# Altium schematic sheet Sheet2.SchDoc
size A3
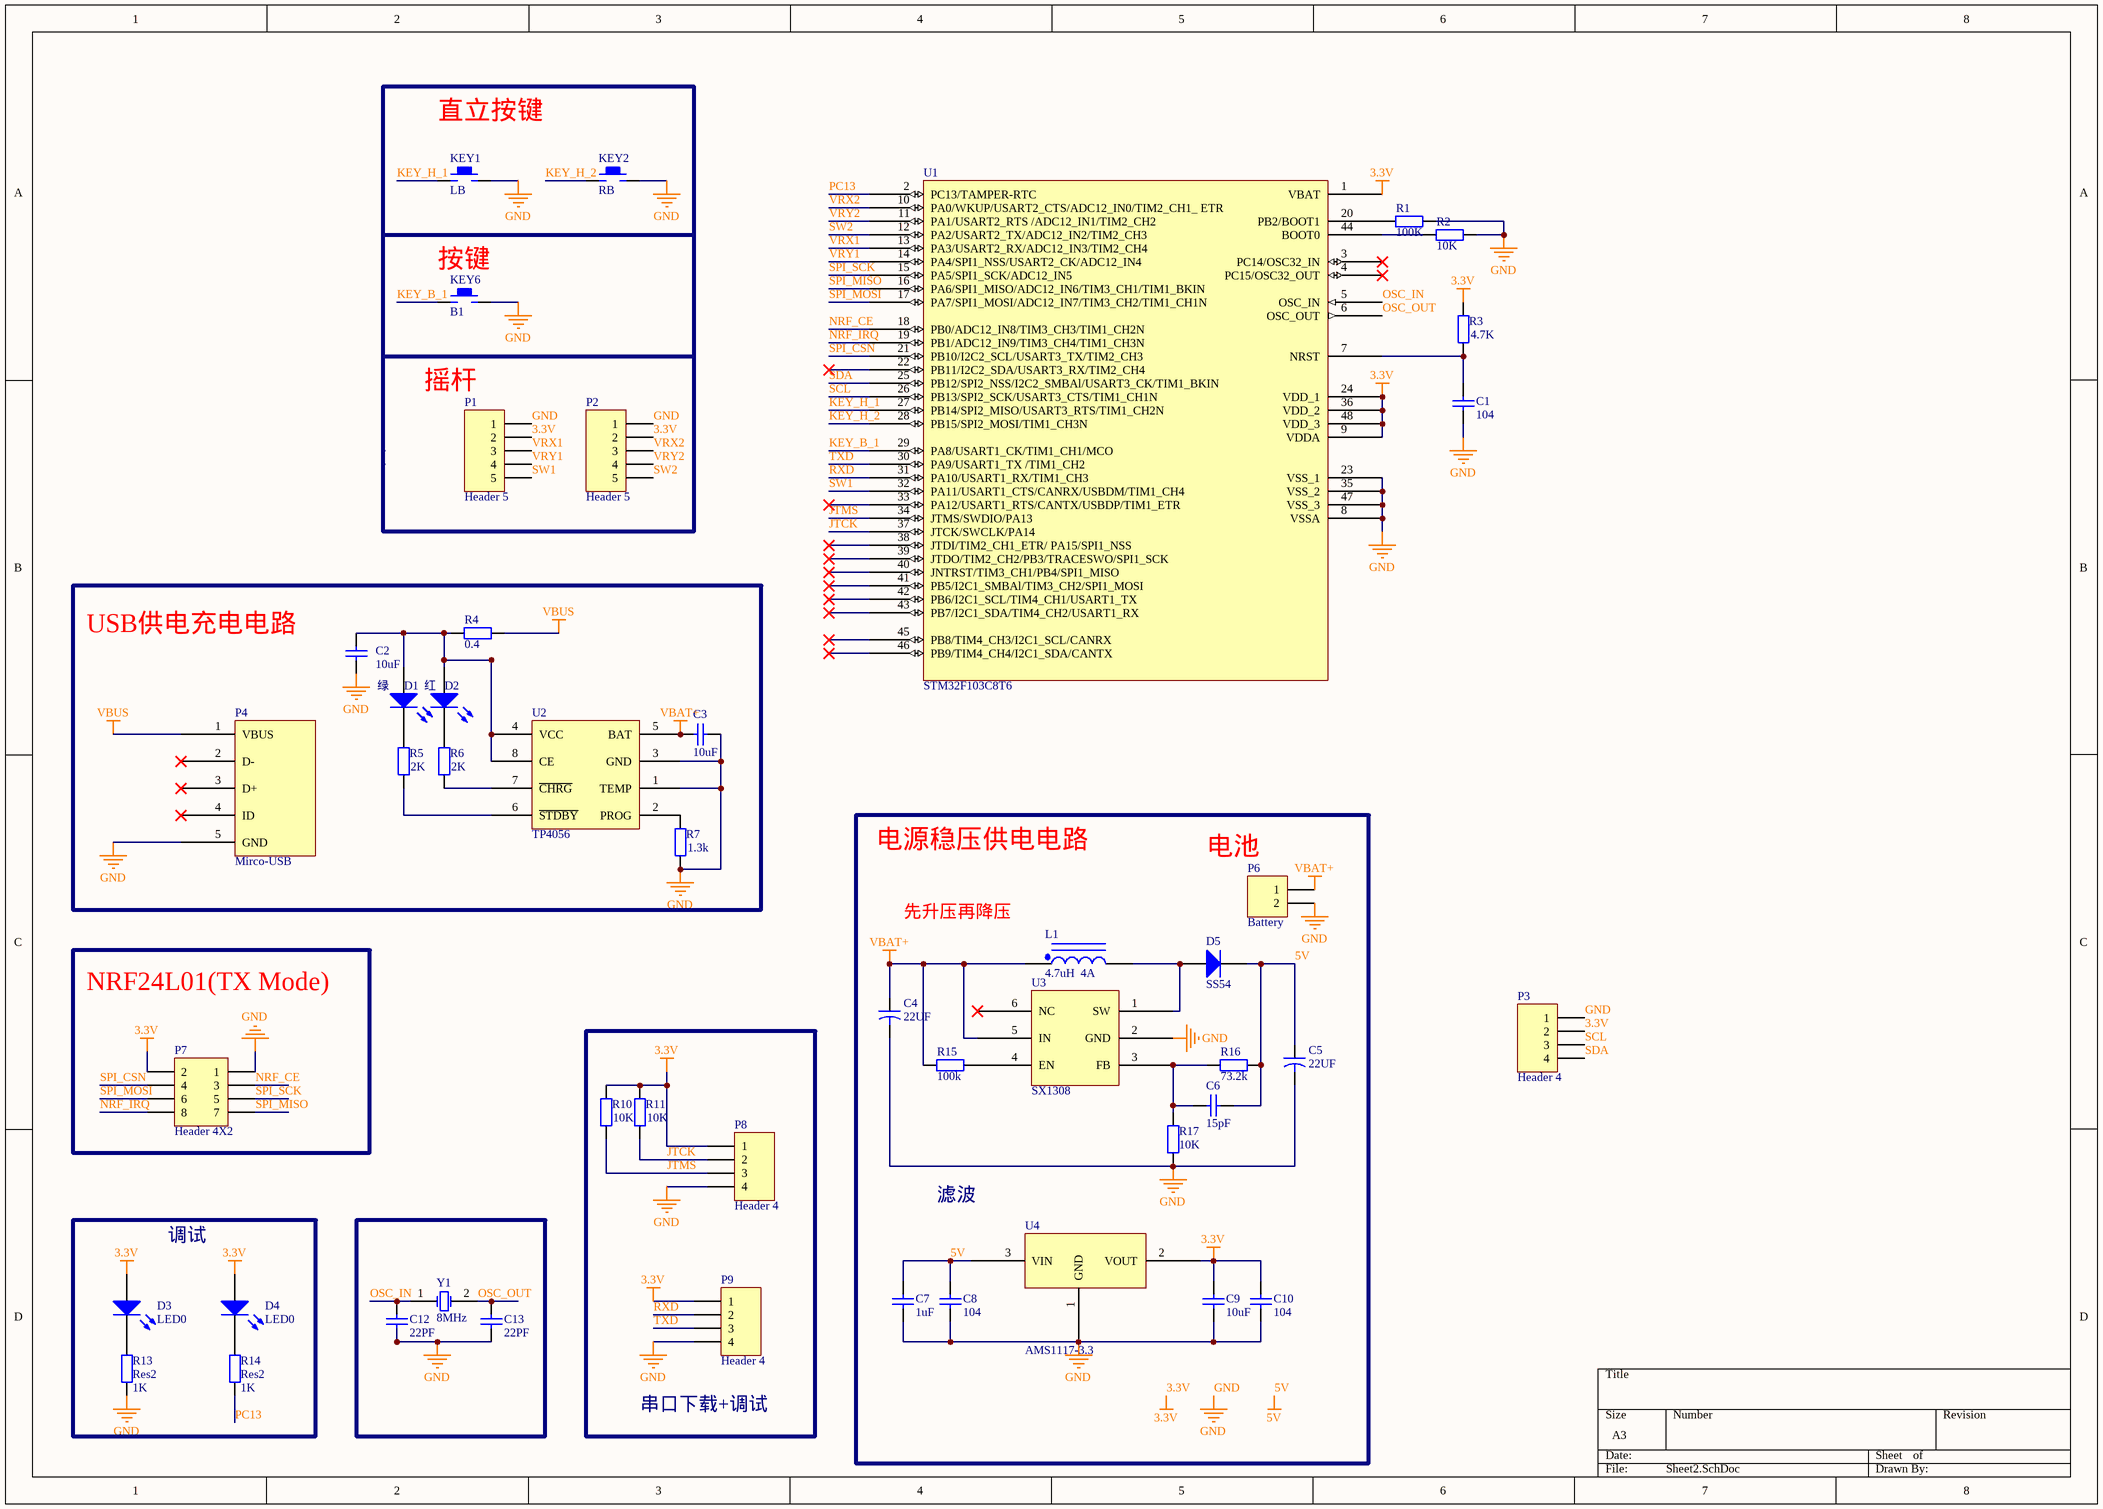
[diagram p0: Sheet2.SchDoc]

## Parts
C1  value 104  [0603]  (hidden comment: Cap)
C2  value 10uF  [0603]  (hidden comment: Cap)
C3  value 10uF  [0603]  (hidden comment: Cap)
C4  value 22UF  [0603]  (hidden comment: Cap2)
C5  value 22UF  [0603]  (hidden comment: Cap2)
C6  value 15pF  [0603]  (hidden comment: Cap)
C7  value 1uF  [0603]  (hidden comment: Cap)
C8  value 104  [0603]  (hidden comment: Cap)
C9  value 10uF  [0603]  (hidden comment: Cap)
C10  value 104  [0603]  (hidden comment: Cap)
C12  value 22PF  [0603]  (hidden comment: Cap)
C13  value 22PF  [0603]  (hidden comment: Cap)
D1  绿  [0603-LED]
D2  红  [0603-LED]
D3  LED0  [0603-LED]
D4  LED0  [0603-LED]
D5  SS54  [DO-214AA/SMB]
KEY1  LB  [KEY 侧式直插]
KEY2  RB  [KEY 侧式直插]
KEY6  B1  [KEY_M]
L1  value 4.7uH  4A  [0603]  (hidden comment: Inductor Iron Dot)
P1  Header 5  [摇杆1]
P2  Header 5  [摇杆1]
P3  Header 4  [HDR1X4]
P4  Mirco-USB  [microUSB]
P6  Battery  [BAT-2]
P7  Header 4X2  [HDR2X4]
P8  Header 4  [HDR1X4]
P9  Header 4  [HDR1X4]
R1  value 100K  [0603]  (hidden comment: Res2)
R2  value 10K  [0603]  (hidden comment: Res2)
R3  value 4.7K  [0603]  (hidden comment: Res2)
R4  value 0.4  [0603]  (hidden comment: Res2)
R5  value 2K  [0603]  (hidden comment: Res2)
R6  value 2K  [0603]  (hidden comment: Res2)
R7  value 1.3k  [0603]  (hidden comment: Res2)
R10  value 10K  [0603]  (hidden comment: Res2)
R11  value 10K  [0603]  (hidden comment: Res2)
R13  Res2  value 1K  [0603]
R14  Res2  value 1K  [0603]
R15  value 100k  [0603]  (hidden comment: Res2)
R16  value 73.2k  [0603]  (hidden comment: Res2)
R17  value 10K  [0603]  (hidden comment: Res2)
U1  STM32F103C8T6  [LQFP-48]
U2  TP4056  [SOIC-8/SOP-8]
U3  SX1308  [sot-23-6]
U4  AMS1117-3.3  [SOT-223]
Y1  8MHz  [LC-HC-49S]

## Blocks framed on the sheet
USB供电充电电路: C2 C3 D1 D2 P4 R4-R7 U2
NRF24L01(TX Mode): P7
串口下载+调试: P8 P9 R10 R11
调试: D3 D4 R13 R14

## Nets
3.3V: C9.2 C10.2 D3.1(A) D4.1(A) P1.2 P2.2 P3.2 P7.2 P8.1 P9.1 R3.2 R10.2 R11.2 U1.1(VBAT) U1.9(VDDA) U1.24(VDD_1) U1.36(VDD_2) U1.48(VDD_3) U4.2(VOUT)
5V: C5.1 C6.1 C7.2 C8.2 D5.2(K) R16.1 U4.3(VIN)
GND: C1.1 C2.1 C3.2 C4.2 C5.2 C7.1 C8.1 C9.1 C10.1 C12.1 C13.1 KEY1.2 KEY2.2 KEY6.2 P1.1 P2.1 P3.1 P4.5(GND) P6.2 P7.1 P8.4 P9.4 R1.1 R2.1 R7.1 R13.1 R17.1 U1.8(VSSA) U1.23(VSS_1) U1.35(VSS_2) U1.47(VSS_3) U2.1(TEMP) U2.3(GND) U3.2(GND) U4.1(GND)
VBAT+: C3.1 C4.1 L1.1 P6.1 R15.2 U2.5(BAT) U3.5(IN)
VBUS: P4.1(VBUS) R4.1
JTCK: P8.2 R11.1 U1.37(JTCK/SWCLK/PA14)
JTMS: P8.3 R10.1 U1.34(JTMS/SWDIO/PA13)
KEY_B_1: KEY6.1 U1.29(PA8/USART1_CK/TIM1_CH1/MCO)
KEY_H_1: KEY1.1 U1.27(PB14/SPI2_MISO/USART3_RTS/TIM1_CH2N)
KEY_H_2: KEY2.1 U1.28(PB15/SPI2_MOSI/TIM1_CH3N)
NRF_CE: P7.3 U1.18(PB0/ADC12_IN8/TIM3_CH3/TIM1_CH2N)
NRF_IRQ: P7.8 U1.19(PB1/ADC12_IN9/TIM3_CH4/TIM1_CH3N)
OSC_IN: C12.2 U1.5(OSC_IN) Y1.1(OSC1)
OSC_OUT: C13.2 U1.6(OSC_OUT) Y1.2(OSC2)
PC13: R14.1 U1.2(PC13/TAMPER-RTC)
RXD: P9.2 U1.31(PA10/USART1_RX/TIM1_CH3)
SCL: P3.3 U1.26(PB13/SPI2_SCK/USART3_CTS/TIM1_CH1N)
SDA: P3.4 U1.25(PB12/SPI2_NSS/I2C2_SMBAl/USART3_CK/TIM1_BKIN)
SPI_CSN: P7.4 U1.21(PB10/I2C2_SCL/USART3_TX/TIM2_CH3)
SPI_MISO: P7.7 U1.16(PA6/SPI1_MISO/ADC12_IN6/TIM3_CH1/TIM1_BKIN)
SPI_MOSI: P7.6 U1.17(PA7/SPI1_MOSI/ADC12_IN7/TIM3_CH2/TIM1_CH1N)
SPI_SCK: P7.5 U1.15(PA5/SPI1_SCK/ADC12_IN5)
SW1: P1.5 U1.32(PA11/USART1_CTS/CANRX/USBDM/TIM1_CH4)
SW2: P2.5 U1.12(PA2/USART2_TX/ADC12_IN2/TIM2_CH3)
TXD: P9.3 U1.30(PA9/USART1_TX_/TIM1_CH2)
VRX1: P1.3 U1.13(PA3/USART2_RX/ADC12_IN3/TIM2_CH4)
VRX2: P2.3 U1.10(PA0/WKUP/USART2_CTS/ADC12_IN0/TIM2_CH1__ETR)
VRY1: P1.4 U1.14(PA4/SPI1_NSS/USART2_CK/ADC12_IN4)
VRY2: P2.4 U1.11(PA1/USART2_RTS_/ADC12_IN1/TIM2_CH2)
NetC1_2: C1.2 R3.1 U1.7(NRST)
NetC2_2: C2.2 D1.1(A) D2.1(A) R4.2 U2.4(VCC) U2.8(CE)
NetC6_2: C6.2 R16.2 R17.2 U3.3(FB)
NetD1_2: D1.2(K) R5.2
NetD2_2: D2.2(K) R6.2
NetD3_2: D3.2(K) R13.2
NetD4_2: D4.2(K) R14.2
NetD5_1: D5.1(A) L1.2 U3.1(SW)
NetR1_2: R1.2 U1.20(PB2/BOOT1)
NetR2_2: R2.2 U1.44(BOOT0)
NetR5_1: R5.1 U2.6(~{STDBY})
NetR6_1: R6.1 U2.7(~{CHRG})
NetR7_2: R7.2 U2.2(PROG)
NetR15_1: R15.1 U3.4(EN)

Not connected (* = marked no-connect by the designer): P4 2(D-)* 3(D+)* 4(ID)*; U1 3(PC14/OSC32_IN)* 4(PC15/OSC32_OUT)* 22(PB11/I2C2_SDA/USART3_RX/TIM2_CH4)* 33(PA12/USART1_RTS/CANTX/USBDP/TIM1_ETR)* 38(JTDI/TIM2_CH1_ETR/_PA15/SPI1_NSS)* 39(JTDO/TIM2_CH2/PB3/TRACESWO/SPI1_SCK)* 40(JNTRST/TIM3_CH1/PB4/SPI1_MISO)* 41(PB5/I2C1_SMBAl/TIM3_CH2/SPI1_MOSI)* 42(PB6/I2C1_SCL/TIM4_CH1/USART1_TX)* 43(PB7/I2C1_SDA/TIM4_CH2/USART1_RX)* 45(PB8/TIM4_CH3/I2C1_SCL/CANRX)* 46(PB9/TIM4_CH4/I2C1_SDA/CANTX)*; U3 6(NC)*

## Notes on the sheet
- 直立按键
- (near KEY6) 按键
- 摇杆
- 电源稳压供电电路
- 电池
- 先升压再降压
- 滤波

## Library data of the parts
C1-C3 C6-C10 C12 C13 = Cap: Capacitor; Published: 8-Jun-2000; LatestRevisionDate: 17-Jul-2002; LatestRevisionNote: Re-released for DXP Platform.; PackageReference: RAD-0.3; Publisher: Altium Limited; PackageDescription: Radial Cap, Thru-Hole; 2 Leads; 0.3 in Pin Spacing
C4 C5 = Cap2: Capacitor; Published: 23-Sep-2002; PackageReference: CAPR5-4X5; Publisher: Altium Limited; PackageDescription: Capacitor; 2 Leads
D1-D4 = LED0: Typical INFRARED GaAs LED; Published: 8-Jun-2000; LatestRevisionDate: 08-Jul-2005; LatestRevisionNote: Mech Layer 1 removed.; PackageReference: LED-0; Publisher: Altium Limited; PackageDescription: LED; 2 Leads
D5 = Diode: Default Diode; Published: 8-Jun-2000; LatestRevisionDate: 17-Jul-2002; LatestRevisionNote: Re-released for DXP Platform.; PackageVersion: Sep-1996; PackageReference: SMC; Publisher: Altium Limited; PackageDescription: DO-214-AB/SMC; 2 C-Bend Leads; Body 7.9 x 5.9 mm, inc. leads (LxW); Code_JEDEC: DO-214-AB
KEY1 KEY2 KEY6 = KEY
L1 = Inductor Iron Dot: Magnetic-Core Inductor with Winding Polarity Marking; Published: 24-Mar-1999; LatestRevisionDate: 17-Jul-2002; LatestRevisionNote: Re-released for DXP Platform.; PackageReference: DIODE_SMC; Publisher: Altium Limited; PackageDescription: Diode; 2 Leads
P1 P2 = Header 5: Header, 5-Pin; LatestRevisionDate: 17-Jul-2002; LatestRevisionNote: Re-released for DXP Platform.; Publisher: Altium Limited
P3 P8 P9 = Header 4: Header, 4-Pin; LatestRevisionDate: 17-Jul-2002; LatestRevisionNote: Re-released for DXP Platform.; Publisher: Altium Limited
P4 = Mirco-USB: USB
P6 = Header 2: Header, 2-Pin; LatestRevisionDate: 17-Jul-2002; LatestRevisionNote: Re-released for DXP Platform.; Publisher: Altium Limited
P7 = Header 4X2: Header, 4-Pin, Dual row; LatestRevisionDate: 17-Jul-2002; LatestRevisionNote: Re-released for DXP Platform.; Publisher: Altium Limited
R1-R7 R10 R11 R13-R17 = Res2: Resistor; Published: 8-Jun-2000; LatestRevisionDate: 17-Jul-2002; LatestRevisionNote: Re-released for DXP Platform.; PackageReference: AXIAL-0.4; Publisher: Altium Limited; PackageDescription: Axial Device, Thru-Hole; 2 Leads; 0.4 in Pin Spacing
U1 = STM32F103C8T6: ST MCU
U2 = TP4056: Battery Charge IC
U4 = AMS1117-3.3: 5V->3.3V
Y1 = XTAL: Crystal Oscillator; Published: 8-Jun-2000; LatestRevisionDate: 17-Jul-2002; LatestRevisionNote: Re-released for DXP Platform.; PackageReference: R38; Publisher: Altium Limited; PackageDescription: Crystal, Thru-Hole; 2 Leads; Body 3.1 x 8.2 mm (Dia.xH)